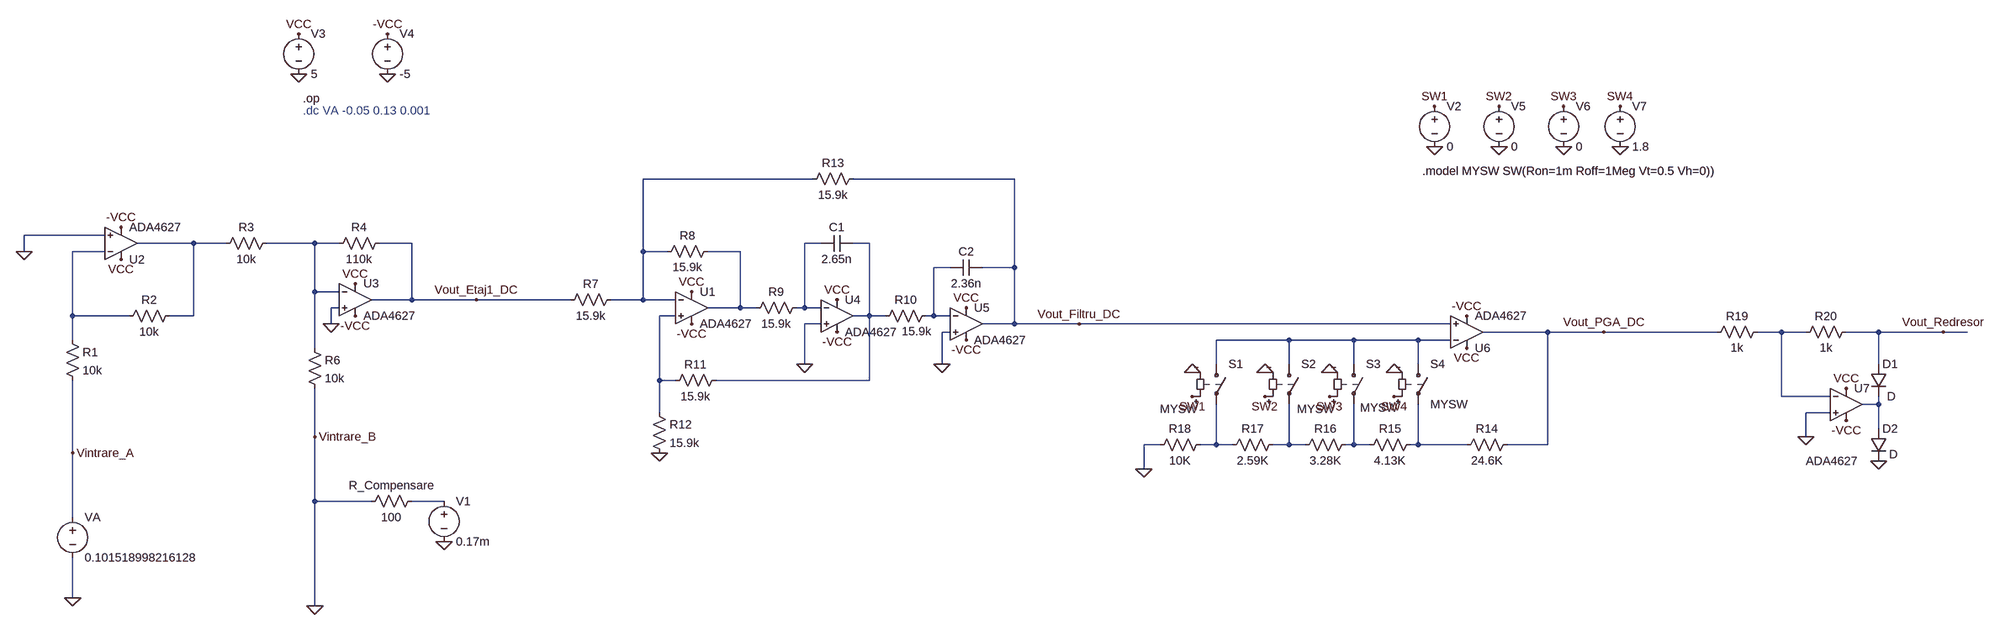
[diagram p0: schematic AnalizaDC (2).asc]
AnalizaDC (2).asc, the LTspice schematic file:
Version 4
SHEET 1 3896 884
WIRE 1552 16 1216 16
WIRE 1952 16 1632 16
WIRE 96 128 -64 128
WIRE 272 144 160 144
WIRE 336 144 272 144
WIRE 512 144 416 144
WIRE 560 144 512 144
WIRE 704 144 640 144
WIRE 1568 144 1536 144
WIRE 1664 144 1632 144
WIRE -64 160 -64 128
WIRE 96 160 32 160
WIRE 1216 160 1216 16
WIRE 1264 160 1216 160
WIRE 1408 160 1344 160
WIRE 1824 192 1792 192
WIRE 1952 192 1952 16
WIRE 1952 192 1888 192
WIRE 512 240 512 144
WIRE 560 240 512 240
WIRE 704 256 704 144
WIRE 704 256 624 256
WIRE 832 256 704 256
WIRE 1072 256 832 256
WIRE 1216 256 1216 160
WIRE 1216 256 1152 256
WIRE 1280 256 1216 256
WIRE 560 272 544 272
WIRE 1408 272 1408 160
WIRE 1408 272 1344 272
WIRE 1440 272 1408 272
WIRE 1536 272 1536 144
WIRE 1536 272 1520 272
WIRE 1568 272 1536 272
WIRE 32 288 32 160
WIRE 144 288 32 288
WIRE 272 288 272 144
WIRE 272 288 224 288
WIRE 1280 288 1248 288
WIRE 1664 288 1664 144
WIRE 1664 288 1632 288
WIRE 1696 288 1664 288
WIRE 1792 288 1792 192
WIRE 1792 288 1776 288
WIRE 1824 288 1792 288
WIRE 544 304 544 272
WIRE 1568 304 1536 304
WIRE 1952 304 1952 192
WIRE 1952 304 1888 304
WIRE 2080 304 1952 304
WIRE 2816 304 2080 304
WIRE 1824 320 1808 320
WIRE 3008 320 2880 320
WIRE 3120 320 3008 320
WIRE 3344 320 3120 320
WIRE 3472 320 3424 320
WIRE 3520 320 3472 320
WIRE 3664 320 3600 320
WIRE 3792 320 3664 320
WIRE 3840 320 3792 320
WIRE 32 336 32 288
WIRE 2496 336 2352 336
WIRE 2624 336 2496 336
WIRE 2752 336 2624 336
WIRE 2816 336 2752 336
WIRE 512 352 512 240
WIRE 1536 384 1536 304
WIRE 1808 384 1808 320
WIRE 2352 384 2352 336
WIRE 2496 384 2496 336
WIRE 2624 384 2624 336
WIRE 2752 384 2752 336
WIRE 3664 384 3664 320
WIRE 1248 416 1248 288
WIRE 1280 416 1248 416
WIRE 1664 416 1664 288
WIRE 1664 416 1360 416
WIRE 3472 448 3472 320
WIRE 3568 448 3472 448
WIRE 3664 464 3664 448
WIRE 3664 464 3632 464
WIRE 1248 480 1248 416
WIRE 3568 480 3520 480
WIRE 3664 512 3664 464
WIRE 512 528 512 432
WIRE 3520 528 3520 480
WIRE 2240 544 2208 544
WIRE 2352 544 2352 464
WIRE 2352 544 2320 544
WIRE 2384 544 2352 544
WIRE 2496 544 2496 464
WIRE 2496 544 2464 544
WIRE 2528 544 2496 544
WIRE 2624 544 2624 464
WIRE 2624 544 2608 544
WIRE 2656 544 2624 544
WIRE 2752 544 2752 464
WIRE 2752 544 2736 544
WIRE 2848 544 2752 544
WIRE 3008 544 3008 320
WIRE 3008 544 2928 544
WIRE 32 560 32 416
WIRE 2208 592 2208 544
WIRE 512 656 512 528
WIRE 624 656 512 656
WIRE 768 656 704 656
WIRE 32 688 32 560
WIRE 32 848 32 768
WIRE 512 864 512 656
FLAG 544 304 0
FLAG 768 736 0
FLAG 512 864 0
FLAG 32 848 0
FLAG -64 160 0
FLAG 480 -192 0
FLAG 656 -192 0
FLAG 656 -272 -VCC
FLAG 480 -272 VCC
FLAG 592 288 -VCC
FLAG 128 112 -VCC
FLAG 592 224 VCC
FLAG 128 176 VCC
FLAG 832 256 Vout_Etaj1_DC
FLAG 32 560 Vintrare_A
FLAG 512 528 Vintrare_B
FLAG 1248 560 0
FLAG 1312 240 VCC
FLAG 1600 256 VCC
FLAG 1856 272 VCC
FLAG 1856 336 -VCC
FLAG 1600 320 -VCC
FLAG 1312 304 -VCC
FLAG 2080 304 Vout_Filtru_DC
FLAG 1536 384 0
FLAG 1808 384 0
FLAG 2208 592 0
FLAG 3152 -48 0
FLAG 3040 -48 0
FLAG 2912 -48 0
FLAG 2784 -48 0
FLAG 2784 -128 SW1
FLAG 2912 -128 SW2
FLAG 3040 -128 SW3
FLAG 3152 -128 SW4
FLAG 3120 320 Vout_PGA_DC
FLAG 2304 448 SW1
FLAG 2448 448 SW2
FLAG 2576 448 SW3
FLAG 2704 448 SW4
FLAG 2848 288 -VCC
FLAG 2848 352 VCC
FLAG 2704 400 0
FLAG 2576 400 0
FLAG 2448 400 0
FLAG 2304 400 0
FLAG 3664 576 0
FLAG 3520 528 0
FLAG 3600 432 VCC
FLAG 3600 496 -VCC
FLAG 3792 320 Vout_Redresor
SYMBOL OpAmps\\ADA4627 128 208 M180
SYMATTR InstName U2
SYMBOL OpAmps\\ADA4627 592 192 R0
SYMATTR InstName U3
SYMBOL res 432 128 R90
WINDOW 0 0 56 VBottom 2
WINDOW 3 32 56 VTop 2
SYMATTR InstName R3
SYMATTR Value 10k
SYMBOL res 656 128 R90
WINDOW 0 0 56 VBottom 2
WINDOW 3 32 56 VTop 2
SYMATTR InstName R4
SYMATTR Value 110k
SYMBOL res 496 336 R0
SYMATTR InstName R6
SYMATTR Value 10k
SYMBOL res 720 640 R90
WINDOW 0 0 56 VBottom 2
WINDOW 3 32 56 VTop 2
SYMATTR InstName R_Compensare
SYMATTR Value 100
SYMBOL voltage 768 640 R0
SYMATTR InstName V1
SYMATTR Value 0.17m
SYMBOL res 240 272 R90
WINDOW 0 0 56 VBottom 2
WINDOW 3 32 56 VTop 2
SYMATTR InstName R2
SYMATTR Value 10k
SYMBOL res 16 320 R0
SYMATTR InstName R1
SYMATTR Value 10k
SYMBOL voltage 32 672 R0
SYMATTR InstName VA
SYMATTR Value 0.101518998216128
SYMBOL voltage 480 -288 R0
SYMATTR InstName V3
SYMATTR Value 5
SYMBOL voltage 656 -288 R0
SYMATTR InstName V4
SYMATTR Value -5
SYMBOL res 1168 240 R90
WINDOW 0 0 56 VBottom 2
WINDOW 3 32 56 VTop 2
SYMATTR InstName R7
SYMATTR Value 15.9k
SYMBOL OpAmps\\ADA4627 1312 208 R0
SYMATTR InstName U1
SYMBOL OpAmps\\ADA4627 1600 224 R0
SYMATTR InstName U4
SYMBOL OpAmps\\ADA4627 1856 240 R0
SYMATTR InstName U5
SYMBOL res 1360 144 R90
WINDOW 0 0 56 VBottom 2
WINDOW 3 32 56 VTop 2
SYMATTR InstName R8
SYMATTR Value 15.9k
SYMBOL res 1536 256 R90
WINDOW 0 0 56 VBottom 2
WINDOW 3 32 56 VTop 2
SYMATTR InstName R9
SYMATTR Value 15.9k
SYMBOL res 1792 272 R90
WINDOW 0 0 56 VBottom 2
WINDOW 3 31 34 VTop 2
SYMATTR InstName R10
SYMATTR Value 15.9k
SYMBOL cap 1632 128 R90
WINDOW 0 0 32 VBottom 2
WINDOW 3 32 32 VTop 2
SYMATTR InstName C1
SYMATTR Value 2.65n
SYMBOL cap 1888 176 R90
WINDOW 0 0 32 VBottom 2
WINDOW 3 32 32 VTop 2
SYMATTR InstName C2
SYMATTR Value 2.36n
SYMBOL res 1376 400 R90
WINDOW 0 0 56 VBottom 2
WINDOW 3 32 56 VTop 2
SYMATTR InstName R11
SYMATTR Value 15.9k
SYMBOL res 1232 464 R0
SYMATTR InstName R12
SYMATTR Value 15.9k
SYMBOL res 1648 0 R90
WINDOW 0 0 56 VBottom 2
WINDOW 3 32 56 VTop 2
SYMATTR InstName R13
SYMATTR Value 15.9k
SYMBOL res 2944 528 R90
WINDOW 0 0 56 VBottom 2
WINDOW 3 32 56 VTop 2
SYMATTR InstName R14
SYMATTR Value 24.6K
SYMBOL res 2752 528 R90
WINDOW 0 0 56 VBottom 2
WINDOW 3 32 56 VTop 2
SYMATTR InstName R15
SYMATTR Value 4.13K
SYMBOL res 2624 528 R90
WINDOW 0 0 56 VBottom 2
WINDOW 3 32 56 VTop 2
SYMATTR InstName R16
SYMATTR Value 3.28K
SYMBOL res 2480 528 R90
WINDOW 0 0 56 VBottom 2
WINDOW 3 32 56 VTop 2
SYMATTR InstName R17
SYMATTR Value 2.59K
SYMBOL res 2336 528 R90
WINDOW 0 0 56 VBottom 2
WINDOW 3 32 56 VTop 2
SYMATTR InstName R18
SYMATTR Value 10K
SYMBOL voltage 2784 -144 R0
SYMATTR InstName V2
SYMATTR Value 0
SYMBOL voltage 2912 -144 R0
SYMATTR InstName V5
SYMATTR Value 0
SYMBOL voltage 3040 -144 R0
SYMATTR InstName V6
SYMATTR Value 0
SYMBOL voltage 3152 -144 R0
SYMATTR InstName V7
SYMATTR Value 1.8
SYMBOL OpAmps\\ADA4627 2848 384 M180
SYMATTR InstName U6
SYMBOL sw 2752 368 R0
SYMATTR InstName S4
SYMATTR Value MYSW
SYMBOL sw 2624 368 R0
WINDOW 3 13 102 Left 2
SYMATTR Value MYSW
SYMATTR InstName S3
SYMBOL sw 2496 368 R0
WINDOW 3 16 105 Left 2
SYMATTR Value MYSW
SYMATTR InstName S2
SYMBOL sw 2352 368 R0
WINDOW 3 -112 105 Left 2
SYMATTR Value MYSW
SYMATTR InstName S1
SYMBOL res 3440 304 R90
WINDOW 0 0 56 VBottom 2
WINDOW 3 32 56 VTop 2
SYMATTR InstName R19
SYMATTR Value 1k
SYMBOL res 3616 304 R90
WINDOW 0 0 56 VBottom 2
WINDOW 3 32 56 VTop 2
SYMATTR InstName R20
SYMATTR Value 1k
SYMBOL OpAmps\\ADA4627 3600 400 R0
WINDOW 3 -80 176 Left 2
SYMATTR InstName U7
SYMBOL diode 3648 384 R0
WINDOW 3 33 64 Left 2
SYMATTR InstName D1
SYMBOL diode 3648 512 R0
WINDOW 3 37 51 Left 2
SYMATTR InstName D2
TEXT 488 -144 Left 2 !.op
TEXT 2760 0 Left 2 !.model MYSW SW(Ron=1m Roff=1Meg Vt=0.5 Vh=0))
TEXT 488 -120 Left 2 ;.dc VA -0.05 0.13 0.001

The netlist it stands for:
* AnalizaDC (2).asc
XU2 0 N006 VCC -VCC N002 ADA4627  ; pins In+ In- V+ V- OUT
XU3 0 N003 VCC -VCC Vout_Etaj1_DC ADA4627  ; pins In+ In- V+ V- OUT
R3 N003 N002 10k
R4 Vout_Etaj1_DC N003 110k
R6 N003 0 10k
R_Compensare N017 0 100
V1 N017 0 0.17m
R2 N002 N006 10k
R1 N006 Vintrare_A 10k
VA Vintrare_A 0 0.101518998216128
V3 VCC 0 5
V4 -VCC 0 -5
R7 N001 Vout_Etaj1_DC 15.9k
XU1 N009 N001 VCC -VCC N007 ADA4627  ; pins In+ In- V+ V- OUT
XU4 0 N004 VCC -VCC N005 ADA4627  ; pins In+ In- V+ V- OUT
XU5 0 N008 VCC -VCC Vout_Filtru_DC ADA4627  ; pins In+ In- V+ V- OUT
R8 N007 N001 15.9k
R9 N004 N007 15.9k
R10 N008 N005 15.9k
C1 N005 N004 2.65n
C2 Vout_Filtru_DC N008 2.36n
R11 N005 N009 15.9k
R12 N009 0 15.9k
R13 Vout_Filtru_DC N001 15.9k
R14 Vout_PGA_DC N016 24.6K
R15 N016 N015 4.13K
R16 N015 N014 3.28K
R17 N014 N013 2.59K
R18 N013 0 10K
V2 SW1 0 0
V5 SW2 0 0
V6 SW3 0 0
V7 SW4 0 1.8
XU6 Vout_Filtru_DC N011 VCC -VCC Vout_PGA_DC ADA4627  ; pins In+ In- V+ V- OUT
S4 N011 N016 SW4 0 MYSW
S3 N011 N015 SW3 0 MYSW
S2 N011 N014 SW2 0 MYSW
S1 N011 N013 SW1 0 MYSW
R19 N010 Vout_PGA_DC 1k
R20 Vout_Redresor N010 1k
XU7 0 N010 VCC -VCC N012 ADA4627  ; pins In+ In- V+ V- OUT
D1 Vout_Redresor N012 D
D2 N012 0 D
.model D D
.lib standard.dio
.op
.model MYSW SW(Ron=1m Roff=1Meg Vt=0.5 Vh=0))
* .dc VA -0.05 0.13 0.001
.backanno
.end